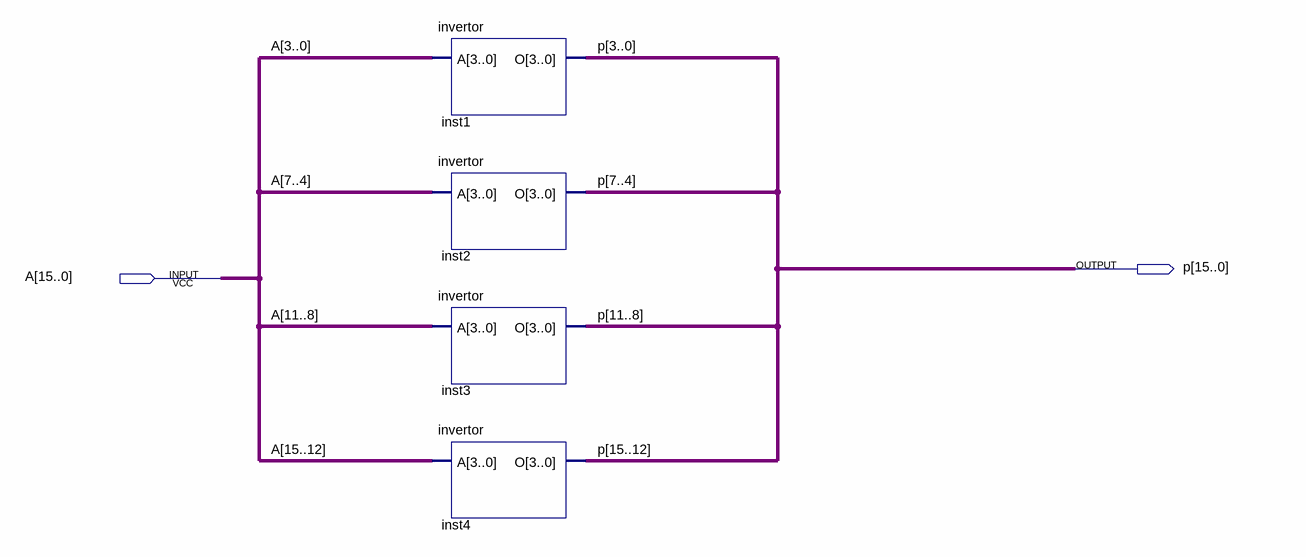
[diagram p0: schematic sheet]
// Quartus schematic onesixinvert.bdf as structural Verilog: 4 symbols, 2 pins
module onesixinvert (
  input  [15:0] A,
  output [15:0] p
);

  invertor inst1 (.A(A[3:0]), .O(p[3:0]));
  invertor inst2 (.A(A[7:4]), .O(p[7:4]));
  invertor inst3 (.A(A[11:8]), .O(p[11:8]));
  invertor inst4 (.A(A[15:12]), .O(p[15:12]));
endmodule
